# Altium schematic sheet RFFE.SchDoc
size A3
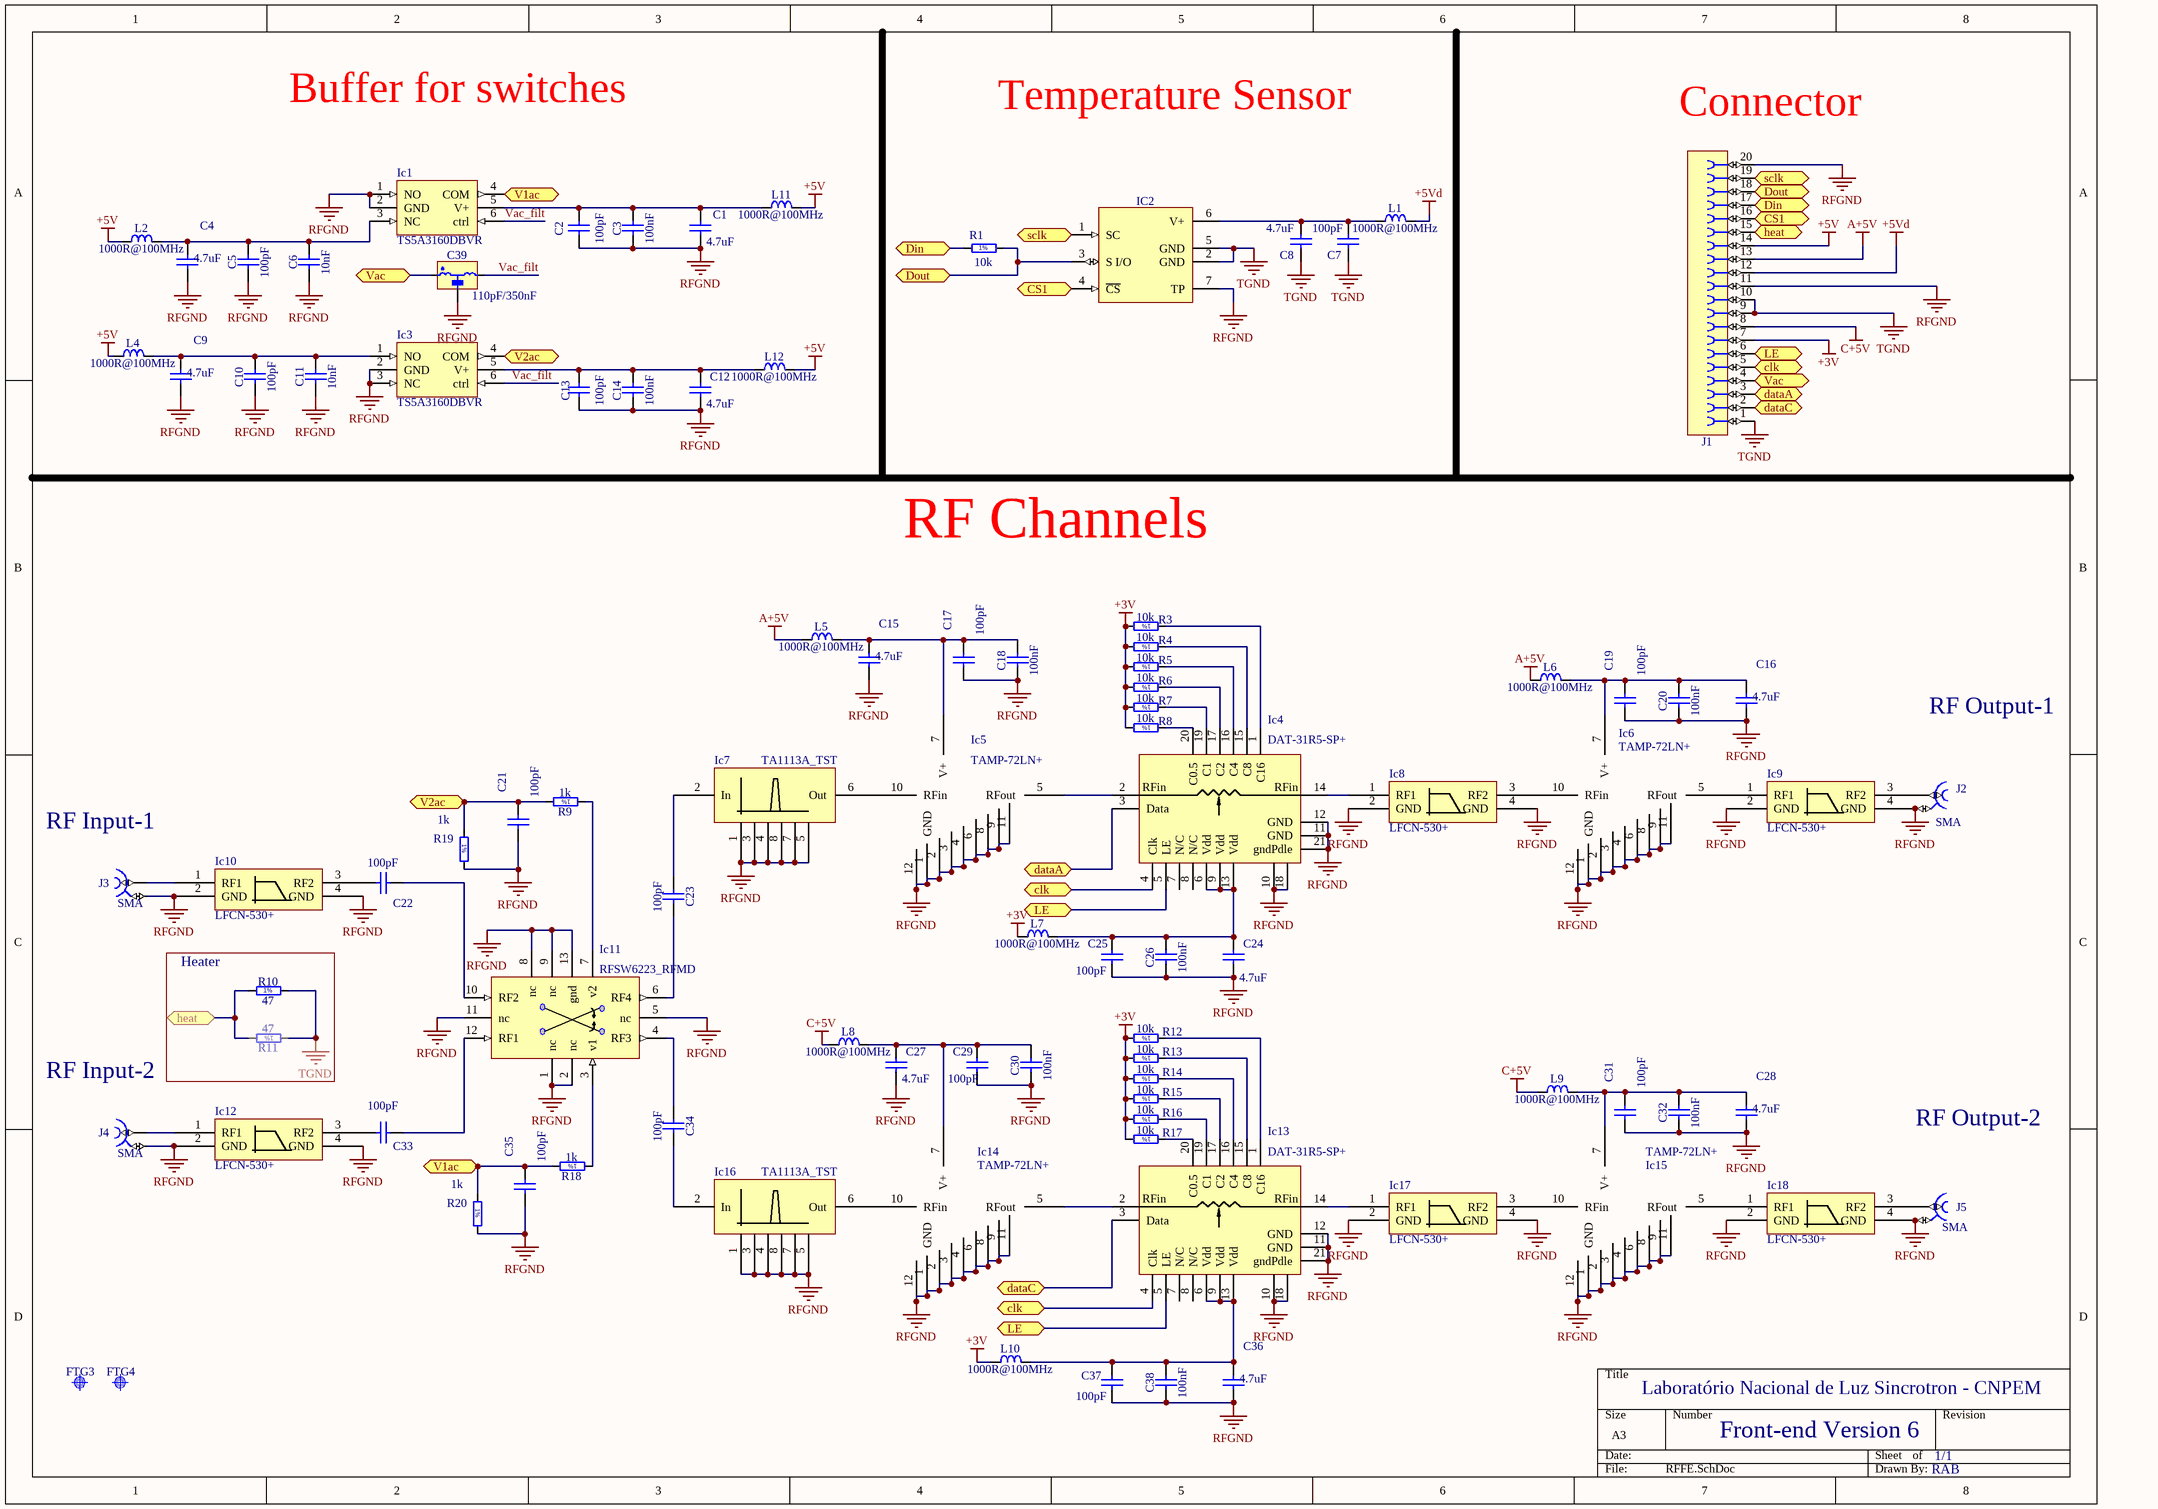
[diagram p0: RFFE.SchDoc]

## Parts
C1  4.7uF  [CAPC1608X90N]
C2  100pF  [CAPC1608X87N]
C3  100nF  [CAPC1608X87N]
C4  4.7uF  [CAPC1608X90N]
C5  100pF  [CAPC1608X87N]
C6  10nF  [CAPC2012X135N]
C7  100pF  [CAPC1608X87N]
C8  4.7uF  [CAPC1608X90N]
C9  4.7uF  [CAPC1608X90N]
C10  100pF  [CAPC1608X87N]
C11  10nF  [CAPC2012X135N]
C12  4.7uF  [CAPC1608X90N]
C13  100pF  [CAPC1608X87N]
C14  100nF  [CAPC1608X87N]
C15  4.7uF  [CAPC1608X90N]
C16  4.7uF  [CAPC1608X90N]
C17  100pF  [CAPC1608X87N]
C18  100nF  [CAPC1608X87N]
C19  100pF  [CAPC1608X87N]
C20  100nF  [CAPC1608X87N]
C21  100pF  [CAPC1608X87N]
C22  100pF  [CAPC1608X87N]
C23  100pF  [CAPC1608X87N]
C24  4.7uF  [CAPC1608X90N]
C25  100pF  [CAPC1608X87N]
C26  100nF  [CAPC1608X87N]
C27  4.7uF  [CAPC1608X90N]
C28  4.7uF  [CAPC1608X90N]
C29  100pF  [CAPC1608X87N]
C30  100nF  [CAPC1608X87N]
C31  100pF  [CAPC1608X87N]
C32  100nF  [CAPC1608X87N]
C33  100pF  [CAPC1608X87N]
C34  100pF  [CAPC1608X87N]
C35  100pF  [CAPC1608X87N]
C36  4.7uF  [CAPC1608X90N]
C37  100pF  [CAPC1608X87N]
C38  100nF  [CAPC1608X87N]
C39  110pF/350nF  [CAPC_MURATA_NFL18ST]
FTG3  Use only in PCB  [FIDUCIAL_TOP_S100-200]  (value not drawn)
FTG4  Use only in PCB  [FIDUCIAL_TOP_S100-200]  (value not drawn)
Ic1  TS5A3160DBVR  [TSOP95P280X145-6N]
IC2  LM71CISD  [SON95P300X300X80-7N-R160X210-NGG0006A]  (value not drawn)
Ic3  TS5A3160DBVR  [TSOP95P280X145-6N]
Ic4  DAT-31R5-SP+  [DG983-1]
Ic5  TAMP-72LN+  [MINI-CIRCUITS_JQ1382]
Ic6  TAMP-72LN+  [MINI-CIRCUITS_JQ1382]
Ic7  TA1113A_TST  [TA111XA-TST]
Ic8  LFCN-530+  [MINI-CIRCUITS_FV1206]
Ic9  LFCN-530+  [MINI-CIRCUITS_FV1206]
Ic10  LFCN-530+  [MINI-CIRCUITS_FV1206]
Ic11  RFSW6223_RFMD  [QFN50P300X300X85_HS-13N1]
Ic12  LFCN-530+  [MINI-CIRCUITS_FV1206]
Ic13  DAT-31R5-SP+  [DG983-1]
Ic14  TAMP-72LN+  [MINI-CIRCUITS_JQ1382]
Ic15  TAMP-72LN+  [MINI-CIRCUITS_JQ1382]
Ic16  TA1113A_TST  [TA111XA-TST]
Ic17  LFCN-530+  [MINI-CIRCUITS_FV1206]
Ic18  LFCN-530+  [MINI-CIRCUITS_FV1206]
J1  Header 20  [SAMTEC_SFM-120-02-S-SH]  (value not drawn)
J2  SMA  [JOHNSON_142-0701-873]
J3  SMA  [JOHNSON_142-0701-873]
J4  SMA  [JOHNSON_142-0701-873]
J5  SMA  [JOHNSON_142-0701-873]
L1  1000R@100MHz  [INDC1608X95N]
L2  1000R@100MHz  [INDC1608X95N]
L4  1000R@100MHz  [INDC1608X95N]
L5  1000R@100MHz  [INDC1608X95N]
L6  1000R@100MHz  [INDC1608X95N]
L7  1000R@100MHz  [INDC1608X95N]
L8  1000R@100MHz  [INDC1608X95N]
L9  1000R@100MHz  [INDC1608X95N]
L10  1000R@100MHz  [INDC1608X95N]
L11  1000R@100MHz  [INDC1608X95N]
L12  1000R@100MHz  [INDC1608X95N]
R1  10k  [RESC1608X55N]
R3  10k  [RESC1608X55N]
R4  10k  [RESC1608X55N]
R5  10k  [RESC1608X55N]
R6  10k  [RESC1608X55N]
R7  10k  [RESC1608X55N]
R8  10k  [RESC1608X55N]
R9  1k  [RESC1608X55N]
R10  47  [RESC6331X70N]
R11  47  [RESC6331X70N]
R12  10k  [RESC1608X55N]
R13  10k  [RESC1608X55N]
R14  10k  [RESC1608X55N]
R15  10k  [RESC1608X55N]
R16  10k  [RESC1608X55N]
R17  10k  [RESC1608X55N]
R18  1k  [RESC1608X55N]
R19  1k  [RESC1608X55N]
R20  1k  [RESC1608X55N]

## Blocks framed on the sheet
Heater: R10 R11

## Ports
clk, CS1, dataA, dataC, Din, Dout, heat, LE, sclk, V1ac, V2ac, Vac

## Nets
+3V: J1.7 L7.1 L10.1 R3.2 R4.2 R5.2 R6.2 R7.2 R8.2 R12.2 R13.2 R14.2 R15.2 R16.2 R17.2
+5V: J1.14 L2.1 L4.1 L11.2 L12.2
+5Vd: J1.12 L1.2
A+5V: J1.13 L5.1 L6.1
C+5V: J1.8 L8.1 L9.1
RFGND: C1.2 C2.1 C3.1 C4.2 C5.1 C6.1 C9.2 C10.1 C11.1 C12.2 C13.2 C14.1 C15.2 C16.2 C17.2 C18.1 C19.2 C20.1 C21.2 C24.2 C25.2 C26.1 C27.2 C28.2 C29.2 C30.1 C31.2 C32.1 C35.2 C36.2 C37.2 C38.1 C39.2 Ic1.1(NO) Ic1.2(GND) IC2.7(TP) Ic3.2(GND) Ic3.3(NC) Ic4.10(GND) Ic4.11(GND) Ic4.12(GND) Ic4.18(GND) Ic4.21(gndPdle) Ic5.1(GND) Ic5.2(GND) Ic5.3(GND) Ic5.4(GND) Ic5.6(GND) Ic5.8(GND) Ic5.9(GND) Ic5.11(GND) Ic5.12(GND) Ic6.1(GND) Ic6.2(GND) Ic6.3(GND) Ic6.4(GND) Ic6.6(GND) Ic6.8(GND) Ic6.9(GND) Ic6.11(GND) Ic6.12(GND) Ic7.1(GND) Ic7.3(GND) Ic7.4(GND) Ic7.5(GND) Ic7.7(GND) Ic7.8(GND) Ic8.2(GND) Ic8.4(GND) Ic9.2(GND) Ic9.4(GND) Ic10.2(GND) Ic10.4(GND) Ic11.1(nc) Ic11.2(nc) Ic11.5(nc) Ic11.8(nc) Ic11.9(nc) Ic11.11(nc) Ic11.13(gnd) Ic12.2(GND) Ic12.4(GND) Ic13.10(GND) Ic13.11(GND) Ic13.12(GND) Ic13.18(GND) Ic13.21(gndPdle) Ic14.1(GND) Ic14.2(GND) Ic14.3(GND) Ic14.4(GND) Ic14.6(GND) Ic14.8(GND) Ic14.9(GND) Ic14.11(GND) Ic14.12(GND) Ic15.1(GND) Ic15.2(GND) Ic15.3(GND) Ic15.4(GND) Ic15.6(GND) Ic15.8(GND) Ic15.9(GND) Ic15.11(GND) Ic15.12(GND) Ic16.1(GND) Ic16.3(GND) Ic16.4(GND) Ic16.5(GND) Ic16.7(GND) Ic16.8(GND) Ic17.2(GND) Ic17.4(GND) Ic18.2(GND) Ic18.4(GND) J1.11 J1.20 J2.2 J3.2 J4.2 J5.2 R19.2 R20.2
TGND: C7.2 C8.1 IC2.2(GND) IC2.5(GND) J1.1 J1.9 J1.10 R10.2 R11.1
clk: Ic4.4(Clk) Ic13.4(Clk) J1.5 ; port clk
CS1: IC2.4(~{CS}) J1.16 ; port CS1
dataA: Ic4.3(Data) J1.3 ; port dataA
dataC: Ic13.3(Data) J1.2 ; port dataC
Din: J1.17 R1.1 ; port Din
Dout: IC2.3(S_I/O) J1.18 R1.2 ; port Dout
heat: J1.15 R10.1 R11.2 ; port heat
LE: Ic4.5(LE) Ic13.5(LE) J1.6 ; port LE
sclk: IC2.1(SC) J1.19 ; port sclk
V1ac: C35.1 Ic1.4(COM) R18.2 R20.1 ; port V1ac
V2ac: C21.1 Ic3.4(COM) R9.2 R19.1 ; port V2ac
Vac: C39.1 J1.4 ; port Vac
Vac_filt: C39.3 Ic1.6(ctrl) Ic3.6(ctrl)
NetC1_1: C1.1 C2.2 C3.2 Ic1.5(V+) L11.1
NetC4_1: C4.1 C5.2 C6.2 Ic1.3(NC) L2.2
NetC7_1: C7.1 C8.2 IC2.6(V+) L1.1
NetC9_1: C9.1 C10.2 C11.2 Ic3.1(NO) L4.2
NetC12_1: C12.1 C13.1 C14.2 Ic3.5(V+) L12.1
NetC15_1: C15.1 C17.1 C18.2 Ic5.7(V+) L5.2
NetC16_1: C16.1 C19.1 C20.2 Ic6.7(V+) L6.2
NetC22_1: C22.1 Ic10.3(RF2)
NetC22_2: C22.2 Ic11.10(RF2)
NetC23_1: C23.1 Ic7.2(In)
NetC23_2: C23.2 Ic11.6(RF4)
NetC24_1: C24.1 C25.1 C26.2 Ic4.6(Vdd) Ic4.9(Vdd) Ic4.13(Vdd) L7.2
NetC27_1: C27.1 C29.1 C30.2 Ic14.7(V+) L8.2
NetC28_1: C28.1 C31.1 C32.2 Ic15.7(V+) L9.2
NetC33_1: C33.1 Ic12.3(RF2)
NetC33_2: C33.2 Ic11.12(RF1)
NetC34_1: C34.1 Ic11.4(RF3)
NetC34_2: C34.2 Ic16.2(In)
NetC36_1: C36.1 C37.1 C38.2 Ic13.6(Vdd) Ic13.9(Vdd) Ic13.13(Vdd) L10.2
NetIc4_1: Ic4.1(C16) R3.1
NetIc4_2: Ic4.2(RFin) Ic5.5(RFout)
NetIc4_14: Ic4.14(RFout) Ic8.1(RF1)
NetIc4_15: Ic4.15(C8) R4.1
NetIc4_16: Ic4.16(C4) R5.1
NetIc4_17: Ic4.17(C2) R6.1
NetIc4_19: Ic4.19(C1) R7.1
NetIc4_20: Ic4.20(C0.5) R8.1
NetIc5_10: Ic5.10(RFin) Ic7.6(Out)
NetIc6_5: Ic6.5(RFout) Ic9.1(RF1)
NetIc6_10: Ic6.10(RFin) Ic8.3(RF2)
NetIc9_3: Ic9.3(RF2) J2.1
NetIc10_1: Ic10.1(RF1) J3.1
NetIc11_3: Ic11.3(v1) R18.1
NetIc11_7: Ic11.7(v2) R9.1
NetIc12_1: Ic12.1(RF1) J4.1
NetIc13_1: Ic13.1(C16) R12.1
NetIc13_2: Ic13.2(RFin) Ic14.5(RFout)
NetIc13_14: Ic13.14(RFout) Ic17.1(RF1)
NetIc13_15: Ic13.15(C8) R13.1
NetIc13_16: Ic13.16(C4) R14.1
NetIc13_17: Ic13.17(C2) R15.1
NetIc13_19: Ic13.19(C1) R16.1
NetIc13_20: Ic13.20(C0.5) R17.1
NetIc14_10: Ic14.10(RFin) Ic16.6(Out)
NetIc15_5: Ic15.5(RFout) Ic18.1(RF1)
NetIc15_10: Ic15.10(RFin) Ic17.3(RF2)
NetIc18_3: Ic18.3(RF2) J5.1

Not connected (* = marked no-connect by the designer): Ic4 7(N/C) 8(N/C); Ic5 0(GND); Ic6 0(GND); Ic13 7(N/C) 8(N/C); Ic14 0(GND); Ic15 0(GND)

## Notes on the sheet
- Buffer for switches
- Temperature Sensor
- (near J1) Connector
- RF Channels
- RF Output-1
- RF Input-1
- RF Input-2
- RF Output-2
- Laboratório Nacional de Luz Sincrotron - CNPEM
- Front-end Version 6
- 1/1
- RAB
- (in symbol R0603_1K_1%_0.1W_100PPM) 1%
- (in symbol R0603_10K_1%_0.1W_100PPM) 1%
- (in symbol R2512_47R_1%_1W_100PPM) 1%

## Library data of the parts
C1 C4 C8 C9 C12 C15 C16 C24 C27 C28 C36 = CC0603_4.7UF_25V_10%_X5R: Non-polarised capacitor; Manufacturer: GENERIC; Part Description: SMD Multilayer Chip Ceramic Capacitor; Manufacturer1 Part Number: GRM188R61E475KE11D; Tolerance: ±10%; Voltage: 25V; TC: X5R; Manufacturer Part Number: CC0603_4.7UF_25V_10%_X5R; Part Number: CC0603_4.7UF_25V_10%_X5R; Component Kind: Standard; Component Type: Standard; Pin Count: 2; Value: 4.7uF; Status: None; Case: 0603; Mounted: Yes; Socket: No; SMD: Yes; Sense: No; Manufacturer1 Example: MURATA; Manufacturer1 ComponentHeight: 0.95mm; HelpURL: \\cern.ch\dfs\Applications\Altium\Datasheets\CC0603_MURATA_GRM188R61E475KE11D.pdf; Author: CERN DEM JLC; CreateDate: 10/11/2014; LatestRevisionDate: 10/11/2014
C2 C5 C7 C10 C13 C17 C19 C21-C23 C25 C29 C31 C33-C35 C37 = CC0603_100PF_50V_5%_NP0: Non-polarised capacitor; Manufacturer: GENERIC; Part Description: SMD Multilayer Chip Ceramic Capacitor; Manufacturer1 Part Number: 223886715101; Tolerance: ±5%; Voltage: 50V; TC: C0G/NP0; Manufacturer Part Number: CC0603_100PF_50V_5%_NP0; Part Number: CC0603_100PF_50V_5%_NP0; Component Kind: Standard; Component Type: Standard; Pin Count: 2; Value: 100pF; Status: Preferred; Case: 0603; Mounted: Yes; Socket: No; SMD: Yes; Sense: No; Manufacturer1 Example: PHYCOMP; Manufacturer1 ComponentHeight: 0.87mm; HelpURL: \\cern.ch\dfs\Applications\Altium\Datasheets\CC0603_NP0_PHYCOMP.pdf; Author: CERN DEM JLC; CreateDate: 03/12/2007; LatestRevisionDate: 03/12/2007
C3 C14 C18 C20 C26 C30 C32 C38 = CC0603_100NF_50V_10%_X7R: Non-polarised capacitor; Manufacturer: GENERIC; Part Description: SMD Multilayer Chip Ceramic Capacitor; Manufacturer1 Part Number: 223858615649; Tolerance: ±10%; Voltage: 50V; TC: X7R; Manufacturer Part Number: CC0603_100NF_50V_10%_X7R; Part Number: CC0603_100NF_50V_10%_X7R; Component Kind: Standard; Component Type: Standard; Pin Count: 2; Value: 100nF; Status: Preferred; Case: 0603; Mounted: Yes; Socket: No; SMD: Yes; Sense: No; Manufacturer1 Example: PHYCOMP; Manufacturer1 ComponentHeight: 0.87mm; HelpURL: \\cern.ch\dfs\Applications\Altium\Datasheets\CC0603_X7R_PHYCOMP.pdf; Author: CERN DEM JLC; CreateDate: 03/12/2007; LatestRevisionDate: 03/12/2007
C6 C11 = CC0805_10NF_50V_5%_C0G: Non-polarised capacitor; Manufacturer: GENERIC; Part Description: SMD Multilayer Chip Ceramic Capacitor; Manufacturer1 Part Number: C0805C103J5GACTU; Tolerance: ±5%; Voltage: 50V; TC: C0G/NP0; Manufacturer Part Number: CC0805_10NF_50V_5%_C0G; Part Number: CC0805_10NF_50V_5%_C0G; Component Kind: Standard; Component Type: Standard; Pin Count: 2; Value: 10nF; Status: None; Case: 0805; Mounted: Yes; Socket: No; SMD: Yes; Sense: No; Manufacturer1 Example: KEMET; Manufacturer1 ComponentHeight: 0.88mm; HelpURL: \\cern.ch\dfs\Applications\Altium\Datasheets\CC0805_C0G_KEMET_(Commercial Grade).pdf; Author: CERN DEM JLC; CreateDate: 02/02/2011; LatestRevisionDate: 22/04/2015
C39 = CEMIF_110PF/350NF_50V_MURATA_NFL18ST506H1A3D: EMI Filter (LC Combined); Part Description: Chip EMIFIL® LC Combined Monolithic, NFL18ST Series; Manufacturer: MURATA; Voltage: 10V; Tolerance: +50%-20%; Part Number: CEMIF_110PF/350NF_50V_MURATA_NFL18ST506H1A3D; Component Kind: Standard; Component Type: Standard; Pin Count: 2; Value: 110pF/350nF; Status: None; Manufacturer Part Number: NFL18ST506H1A3D; Case: 0603; Mounted: Yes; Socket: No; SMD: Yes; Sense: No; ComponentHeight: 0.7mm; HelpURL: \\cern.ch\dfs\Applications\Altium\Datasheets\CEMIF_MURATA_NFL18ST.pdf; Author: CERN DEM JLC; CreateDate: 18/11/2014; LatestRevisionDate: 18/11/2014
FTG3 FTG4 = FIDUCIAL_TARGET_S100-200: Fiducial Target; Part Description: Square Fiducial Target, Top Layer, 1.0mm, Top Solder 2.0mm, Keepout =2.0mm; Mounted: No; Part Number: FIDUCIAL_TARGET_S100-200; Component Kind: Standard (No BOM); Component Type: Standard (No BOM); Pin Count: 1; Family: Fiducial; Socket: No; SMD: Yes; Sense: No; Status: None; ComponentHeight: 0mm; HelpURL: Undefined; Author: CERN DEM JLC; CreateDate: 09/02/2010; LatestRevisionDate: 04/04/2012; PackageDescription: Square Fiducial Target, Top Layer, 1.0mm, Top Solder 2.0mm, Keepout =2.0mm
Ic1 Ic3 = TS5A3160DBVR: IC SWITCH SPDT SOT23-6; Manufacturer: Texas Instruments; Circuit: 1 x SPDT; On-State Resistance: 900 mOhm; Voltage Supply Source: Single Supply; Voltage - Supply, Single/Dual (±): 1.65 V ~ 5.5 V; Current - Supply: 10nA; Supplier 1: Digi-Key; RoHS: RoHS Compliant; Category: Integrated Circuits (ICs); Stock 1: 7833; Pricing 1: 1=0.68, 10=0.577, 25=0.5056, 100=0.4326, 250=0.3752, 500=0.3178, 1000=0.245 (USD); Packaging: Digi-Reel®; Function: Switch; Operating Temperature: -40°C ~ 85°C; Mounting Type: Surface Mount; Package / Case: SOT-23-6; Supplier Device Package: SOT-23-6; ComponentLink1URL: http://www.ti.com/lit/ds/symlink/ts5a3160.pdf; ComponentLink1Description: http://www.ti.com/lit/ds/symlink/ts5a3160.pdf; Supplier Part Number 1: 296-21189-6-ND; Manufacturer Part Number: TS5A3160DBVR
IC2 = LM71CISD: LM71/LM71-Q1 SPI/MICROWIRE 13-Bit Plus Sign Temperature Sensor; Manufacturer: TEXAS INSTRUMENTS; PressFit: No; Device: LM71CISD; Component Kind: Standard; Component Type: Standard; Package Description: SON, 0.95mm Pitch; 6 Pin, 3.00mm W X 3mm L X 0.80mm H body (w/Thermal Tab 1.6mm x 2.1mm); Manufacturer Part Number: LM71CISD; Part Number: LM71CISD; PackageDescription: SON, 0.95mm Pitch; 6 Pin, 3.00mm W X 3mm L X 0.80mm H body (w/Thermal Tab 1.6mm x 2.1mm); Part Description: LM71/LM71-Q1 SPI/MICROWIRE 13-Bit Plus Sign Temperature Sensor; Pin Count: 6; Mounted: Yes; Socket: No; SMD: Yes; ComponentHeight: 0.8mm; Author: LNLS DIG LOS; CreateDate: 10/07/2017; LatestRevisionDate: 10/07/2017
Ic4 Ic13 = DAT-31R5-SP+: Serial Digital Step Attenuator 31.5 step:0.5dB; Manufacturer: MINI-CIRCUITS; Manufacturer Part Number: DAT-31R5-SN+; PressFit: No; Bonding: No; ComponentLink1Description: http://www.minicircuits.com/pdfs/DAT-31R5-SP+.pdf; ComponentLink1URL: http://www.minicircuits.com/pdfs/DAT-31R5-SP+.pdf; Part Number: DAT-31R5-SP+; Component Kind: Standard; Component Type: Standard; Device: DAT-31R5-SP+; Footprint: MINI-CIRCUITS_DG983-1; PackageDescription: MINI-CIRCUITS DG983-1 Case, 0.50mm Pitch, Square; 5 Pin X 5 Pin, 4mm X 4mm Body (w/Thermal Tab 2.21 X 2.21 mm); Part Description: Serial Digital Step Attenuator 31.5 step:0.5dB; Pin Count: 21; Mounted: Yes; Socket: No; SMD: Yes; Sense: No; ComponentHeight: 0.9mm; Author: LNLS DIG FCS; HelpURL: http://www.minicircuits.com/pdfs/DAT-31R5-SP+.pdf; CreateDate: 06/07/2016; LatestRevisionDate: 06/07/2016
Ic5 Ic6 Ic14 Ic15 = TAMP-72LN+: LNA 20 dB Low Noise Figure; Manufacturer: MINI-CIRCUITS; PressFit: No; Bonding: No; ComponentLink1Description: http://www.minicircuits.com/pdfs/TAMP-72LN+.pdf; Manufacturer Part Number: MINI-CIRCUITS_JQ1382; ComponentLink1URL: http://www.minicircuits.com/pdfs/TAMP-72LN+.pdf; Part Number: TAMP-72LN+; Component Kind: Standard; Component Type: Standard; Device: TAMP-72LN+; PackageDescription: MINI-CIRCUITS - JQ1382 Case, ~ 2.55mm Pitch, 4 Pin X 3 Pin, 13.3mm X 18.5mm Body (w/Thermal Tab 4 X 8 mm); Part Description: LNA 20 dB Low Noise Figure; Pin Count: 12; Case: JQ1382; Mounted: Yes; Socket: No; SMD: Yes; Sense: No; ComponentHeight: 8.5mm; Author: LNLS DIG FCS; HelpURL: http://www.minicircuits.com/pdfs/TAMP-72LN+.pdf; CreateDate: 07/07/2016; LatestRevisionDate: 07/07/2016
Ic7 Ic16 = TA1113A_TST: Manufacturer: Tai-Saw Technology Co; Part Description: SAW FILTER 475 MHZ; PressFit: No; Bonding: No; Manufacturer Part Number: TA1113A; ComponentLink1URL: http://www.taisaw.com/upload/product/TA1113A%20_Rev.1.0_.pdf; ComponentLink1Description: http://www.taisaw.com/upload/product/TA1113A%20_Rev.1.0_.pdf; Part Number: TA1113A_TST; Component Kind: Standard; Component Type: Standard; Device: TA1113A_TST; PackageDescription: TA111XA-TST Pitch 1.27mm, SMD 3.8x3.8; Pin Count: 8; Mounted: Yes; Socket: No; SMD: Yes; Sense: No; ComponentHeight: 1.4mm; Author: LNLS DIG FCS; HelpURL: http://www.taisaw.com/upload/product/TA1113A%20_Rev.1.0_.pdf; CreateDate: 07/07/2016; LatestRevisionDate: 07/07/2016
Ic8-Ic10 Ic12 Ic17 Ic18 = LFCN-530+: Low Pass Filter 3dB@530MHz; Manufacturer: MINI-CIRCUITS; PressFit: No; Bonding: No; ComponentLink1Description: http://www.minicircuits.com/pdfs/LFCN-530.pdf; Manufacturer Part Number: LFCN-530+; ComponentLink1URL: http://www.minicircuits.com/pdfs/LFCN-530.pdf; Part Number: LFCN-530+; Component Kind: Standard; Component Type: Standard; Device: LFCN-530+; PackageDescription: MINI-CIRCUITS FV1206 Case, 4 Pin, 4.5mm W X 3.3mm L; Part Description: Low Pass Filter 3dB@530MHz; Pin Count: 4; Case: FV1206; Mounted: Yes; Socket: No; SMD: Yes; Sense: No; ComponentHeight: 0.94mm; Author: LNLS DIG FCS; HelpURL: https://www.minicircuits.com/pdfs/LFCN-530.pdf; CreateDate: 07/07/2016; LatestRevisionDate: 07/07/2016
Ic11 = RFSW6223_RFMD: CrossbarSwitch; Manufacturer: RFMD; Part Description: DPDT SYMMETRIC SWITCH 10MHZ TO 6000MHZ; PressFit: No; Bonding: No; Manufacturer Part Number: RFSW6223_RFMD; ComponentLink1URL: http://www.rfmw.com/datasheets/rfmd/rfsw6223.pdf; ComponentLink1Description: http://www.rfmw.com/datasheets/rfmd/rfsw6223.pdf; Part Number: RFSW6223_RFMD; Component Kind: Standard; Component Type: Standard; Device: RFSW6223_RFMD; PackageDescription: QFN, 0.50mm Pitch, Square; 12 Pin, 3.00mm L X 3.00mm W X 1.00mm H Body (w/Thermal Tab 1.15 X 1.15mm), IPC Medium Density; Pin Count: 13; Case: QFN12; Mounted: Yes; Socket: No; SMD: Yes; Sense: No; ComponentHeight: 0.85mm; Author: LNLS DIG FCS; HelpURL: http://www.rfmd.com/store/downloads/dl/file/id/28094/rfsw6223_data_sheet.pdf; CreateDate: 07/07/2016; LatestRevisionDate: 07/07/2016
J1 = SAMTEC_SFM-120-02-S-SH: Connector 20 Female; Part Description: 20 Contacts - Pitch 1.27mm - Single Row Right Angle Header; Manufacturer: SAMTEC; PressFit: No; Part Number: SAMTEC_SFM-120-02-S-SH; Component Kind: Standard; Component Type: Standard; Pin Count: 20; Family: Header 20; Mounted: Yes; Socket: No; Sense: No; SMD: Yes; Status: None; Manufacturer Part Number: SFM-120-02-S-SH; ComponentHeight: 2.41mm; HelpURL: http://suddendocs.samtec.com/catalog_english/sfm.pdf; Author: LNLS DIG FCS; CreateDate: 06/07/2016; LatestRevisionDate: 06/07/2016
J2-J5 = JOHNSON_142-0701-873: Part Description: SMA End Launch Straight Bulkhead Jack Receptacle - Round Contact; PressFit: No; Manufacturer: JOHNSON; Manufacturer Part Number: 142-0701-873; Part Number: JOHNSON_142-0701-873; Component Kind: Standard; Component Type: Standard; Pin Count: 2; Family: SMA; Mounted: Yes; Socket: No; SMD: No; Sense: No; Status: None; ComponentHeight: 8.05mm; HelpURL: \\cern.ch\dfs\Applications\Altium\Datasheets\JOHNSON_142-0701-873.pdf; Author: CERN DEM JLC; CreateDate: 11/05/2009; LatestRevisionDate: 11/05/2009
L1 L2 L4-L12 = IND0603_MURATA_BLM18HE102SN1: Inductor; Part Description: SMD EMIFIL Suppression Chip Ferrite Bead; Manufacturer: MURATA; Power: 600mA; Resistance: 0.35R; Tolerance: ±25%; Part Number: IND0603_MURATA_BLM18HE102SN1; Component Kind: Standard; Component Type: Standard; Pin Count: 2; Value: 1000R@100MHz; Status: None; Manufacturer Part Number: BLM18HE102SN1; Case: 0603; Mounted: Yes; Socket: No; SMD: Yes; Sense: No; ComponentHeight: 0.95mm; HelpURL: \\cern.ch\dfs\Applications\Altium\Datasheets\IND0603_MURATA_BLM18H.pdf; Author: CERN DEM JLC; CreateDate: 09/12/2013; LatestRevisionDate: 09/12/2013
R1 R3-R8 R12-R17 = R0603_10K_1%_0.1W_100PPM: Resistor - 1%; Manufacturer: GENERIC; Part Description: General Purpose Thick Film Chip Resistor; Manufacturer1 Part Number: NRC06F1002TRF; Power: 0.1W; TC: ±100ppm/°C; Manufacturer Part Number: R0603_10K_1%_0.1W_100PPM; Tolerance: ±1%; Part Number: R0603_10K_1%_0.1W_100PPM; Component Kind: Standard; Component Type: Standard; Pin Count: 2; Value: 10k; Status: Preferred; Case: 0603; Mounted: Yes; Sense: No; Socket: No; SMD: Yes; Manufacturer1 Example: NIC COMPONENT; Manufacturer1 ComponentHeight: 0.55mm; HelpURL: \\cern.ch\dfs\Applications\Altium\Datasheets\R0603_NIC_NRC.pdf; Author: CERN DEM JLC; CreateDate: 03/12/2007; LatestRevisionDate: 13/03/2008
R9 R18-R20 = R0603_1K_1%_0.1W_100PPM: Resistor - 1%; Manufacturer: GENERIC; Part Description: General Purpose Thick Film Chip Resistor; Manufacturer1 Part Number: NRC06F1001TRF; Power: 0.1W; TC: ±100ppm/°C; Tolerance: ±1%; Manufacturer Part Number: R0603_1K_1%_0.1W_100PPM; Part Number: R0603_1K_1%_0.1W_100PPM; Component Kind: Standard; Component Type: Standard; Pin Count: 2; Value: 1k; Status: Preferred; Case: 0603; Mounted: Yes; Sense: No; Socket: No; SMD: Yes; Manufacturer1 Example: NIC COMPONENT; Manufacturer1 ComponentHeight: 0.55mm; HelpURL: \\cern.ch\dfs\Applications\Altium\Datasheets\R0603_NIC_NRC.pdf; Author: CERN DEM JLC; CreateDate: 03/12/2007; LatestRevisionDate: 13/03/2008
R10 = R2512_47R_1%_1W_100PPM: Resistor - 1%; Part Description: Thick Film Chip Resistor; Manufacturer: GENERIC; Manufacturer1 Part Number: 232276364709L or RC2512FK-0747RL; Power: 1W; TC: ±100ppm/°C; Part Number: R2512_47R_1%_1W_100PPM; Component Kind: Standard; Component Type: Standard; Pin Count: 2; Value: 47; Status: Preferred; Tolerance: ±1%; Manufacturer Part Number: R2512_47R_1%_1W_100PPM; Case: 2512; Mounted: Yes; Sense: No; Socket: No; SMD: Yes; Manufacturer1 Example: YAGEO PHYCOMP; Manufacturer1 ComponentHeight: 0.65mm; HelpURL: \\cern.ch\dfs\Applications\Altium\Datasheets\R2512_Phycomp_RC2512.pdf; Author: CERN DEM JLC; CreateDate: 21/07/2008; LatestRevisionDate: 17/10/2012
R11 = R2512_47R_1%_1W_100PPM: Resistor - 1%; Manufacturer: GENERIC; Part Description: Thick Film Chip Resistor; Manufacturer1 Part Number: 232276364709L or RC2512FK-0747RL; Power: 1W; TC: ±100ppm/°C; Manufacturer Part Number: R2512_47R_1%_1W_100PPM; Tolerance: ±1%; Part Number: R2512_47R_1%_1W_100PPM; Component Kind: Standard; Component Type: Standard; Pin Count: 2; Value: 47; Status: Preferred; Case: 2512; Mounted: Yes; Sense: No; Socket: No; SMD: Yes; Manufacturer1 Example: YAGEO PHYCOMP; Manufacturer1 ComponentHeight: 0.65mm; HelpURL: \\cern.ch\dfs\Applications\Altium\Datasheets\R2512_Phycomp_RC2512.pdf; Author: CERN DEM JLC; CreateDate: 21/07/2008; LatestRevisionDate: 17/10/2012